# Altium schematic sheet Main.SchDoc
size A4; SheetNumber: 1; SheetTotal: 8
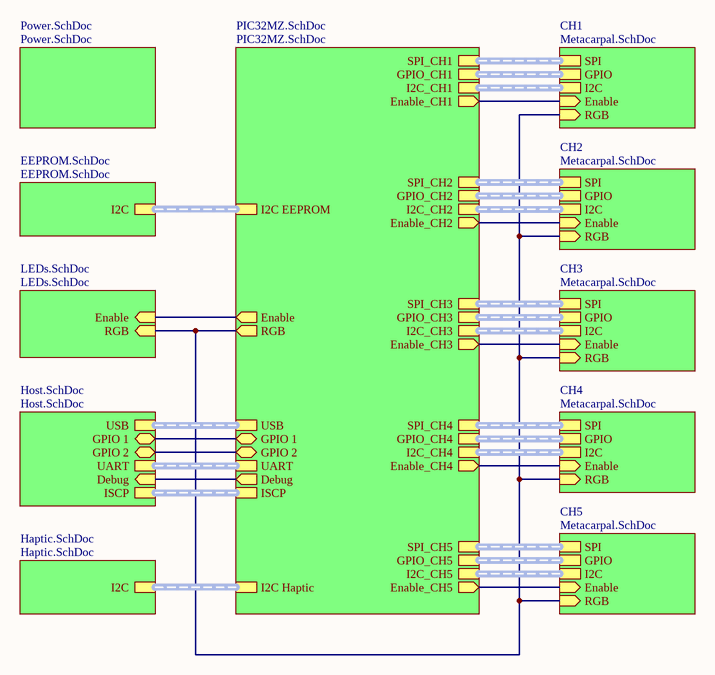
[diagram p0: Main.SchDoc]

## Sub-sheets
CH1 = Metacarpal.SchDoc: I2C (harness I2C), SPI (harness SPI), GPIO (harness GPIO), RGB (in), Enable (in)
CH2 = Metacarpal.SchDoc: I2C (harness I2C), SPI (harness SPI), GPIO (harness GPIO), RGB (in), Enable (in)
CH3 = Metacarpal.SchDoc: I2C (harness I2C), SPI (harness SPI), GPIO (harness GPIO), RGB (in), Enable (in)
CH4 = Metacarpal.SchDoc: I2C (harness I2C), SPI (harness SPI), GPIO (harness GPIO), RGB (in), Enable (in)
CH5 = Metacarpal.SchDoc: I2C (harness I2C), SPI (harness SPI), GPIO (harness GPIO), RGB (in), Enable (in)
EEPROM.SchDoc = EEPROM.SchDoc: I2C (harness I2C)
Haptic.SchDoc = Haptic.SchDoc: I2C (harness I2C)
Host.SchDoc = Host.SchDoc: UART (harness UART), USB (harness USB), ISCP (harness ICSP), Debug (in), GPIO 1 (bidir), GPIO 2 (bidir)
LEDs.SchDoc = LEDs.SchDoc: RGB (in), Enable (in)
PIC32MZ.SchDoc = PIC32MZ.SchDoc: I2C EEPROM (harness I2C), I2C Haptic (harness I2C), SPI_CH1 (harness SPI), GPIO_CH1 (harness GPIO), I2C_CH1 (harness I2C), SPI_CH2 (harness SPI), GPIO_CH2 (harness GPIO), I2C_CH2 (harness I2C), SPI_CH3 (harness SPI), GPIO_CH3 (harness GPIO), I2C_CH3 (harness I2C), SPI_CH4 (harness SPI), GPIO_CH4 (harness GPIO), I2C_CH4 (harness I2C), SPI_CH5 (harness SPI), GPIO_CH5 (harness GPIO), I2C_CH5 (harness I2C), UART (harness UART), USB (harness USB), ISCP (harness ICSP), RGB (out), Enable (out), Enable_CH1 (out), Enable_CH2 (out), Enable_CH5 (out), Enable_CH4 (out), Enable_CH3 (out), Debug (out), GPIO 2 (bidir), GPIO 1 (bidir)
Power.SchDoc = Power.SchDoc: no entries

## Nets
(unnamed): sheet PIC32MZ.SchDoc/RGB, sheet CH1/RGB, sheet LEDs.SchDoc/RGB, sheet CH2/RGB, sheet CH3/RGB, sheet CH4/RGB, sheet CH5/RGB
(unnamed): sheet PIC32MZ.SchDoc/Enable, sheet LEDs.SchDoc/Enable
(unnamed): sheet PIC32MZ.SchDoc/Enable_CH1, sheet CH1/Enable
(unnamed): sheet PIC32MZ.SchDoc/Enable_CH2, sheet CH2/Enable
(unnamed): sheet PIC32MZ.SchDoc/Enable_CH5, sheet CH5/Enable
(unnamed): sheet PIC32MZ.SchDoc/Enable_CH4, sheet CH4/Enable
(unnamed): sheet PIC32MZ.SchDoc/Enable_CH3, sheet CH3/Enable
(unnamed): sheet PIC32MZ.SchDoc/Debug, sheet Host.SchDoc/Debug
(unnamed): sheet PIC32MZ.SchDoc/GPIO 2, sheet Host.SchDoc/GPIO 2
(unnamed): sheet PIC32MZ.SchDoc/GPIO 1, sheet Host.SchDoc/GPIO 1

## Buses and harness runs
harness sheet CH1/GPIO = sheet PIC32MZ.SchDoc/GPIO_CH1
harness sheet CH1/I2C = sheet PIC32MZ.SchDoc/I2C_CH1
harness sheet CH1/SPI = sheet PIC32MZ.SchDoc/SPI_CH1
harness sheet CH2/GPIO = sheet PIC32MZ.SchDoc/GPIO_CH2
harness sheet CH2/I2C = sheet PIC32MZ.SchDoc/I2C_CH2
harness sheet CH2/SPI = sheet PIC32MZ.SchDoc/SPI_CH2
harness sheet CH3/GPIO = sheet PIC32MZ.SchDoc/GPIO_CH3
harness sheet CH3/I2C = sheet PIC32MZ.SchDoc/I2C_CH3
harness sheet CH3/SPI = sheet PIC32MZ.SchDoc/SPI_CH3
harness sheet CH4/GPIO = sheet PIC32MZ.SchDoc/GPIO_CH4
harness sheet CH4/I2C = sheet PIC32MZ.SchDoc/I2C_CH4
harness sheet CH4/SPI = sheet PIC32MZ.SchDoc/SPI_CH4
harness sheet CH5/GPIO = sheet PIC32MZ.SchDoc/GPIO_CH5
harness sheet CH5/I2C = sheet PIC32MZ.SchDoc/I2C_CH5
harness sheet CH5/SPI = sheet PIC32MZ.SchDoc/SPI_CH5
harness sheet EEPROM.SchDoc/I2C = sheet PIC32MZ.SchDoc/I2C EEPROM
harness sheet Haptic.SchDoc/I2C = sheet PIC32MZ.SchDoc/I2C Haptic
harness sheet Host.SchDoc/ISCP = sheet PIC32MZ.SchDoc/ISCP
harness sheet Host.SchDoc/UART = sheet PIC32MZ.SchDoc/UART
harness sheet Host.SchDoc/USB = sheet PIC32MZ.SchDoc/USB

## Notes on the sheet
- TITLE
- SIZE
- A4
- VARIANT
- PROJECT
- SHEET
- VERSION
- OF
- AUTHOR
- DATE